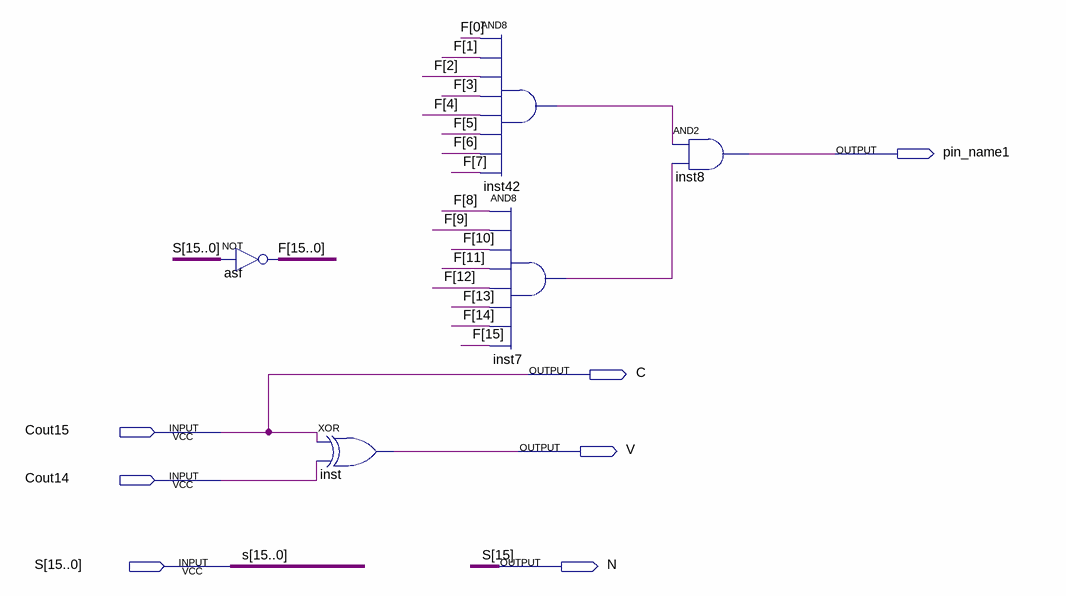
[diagram p0: schematic sheet]
// Quartus schematic variouslogic5.bdf as structural Verilog: 5 symbols, 7 pins
module variouslogic5 (
  input  Cout15,
  input  Cout14,
  input  [15:0] S,
  output pin_name1,
  output C,
  output V,
  output N
);

  wire inst7_out, inst42_out;
  wire [15:0] F;

  assign F = ~S;  // NOT asf, 16 bits wide
  xor inst (V, Cout15, Cout14);
  and inst42 (inst42_out, F[0], F[1], F[2], F[3], F[4], F[5], F[6], F[7]);
  and inst7 (inst7_out, F[8], F[9], F[10], F[11], F[12], F[13], F[14], F[15]);
  and inst8 (pin_name1, inst42_out, inst7_out);

  assign C = Cout15;
  assign N = S[15];
endmodule
